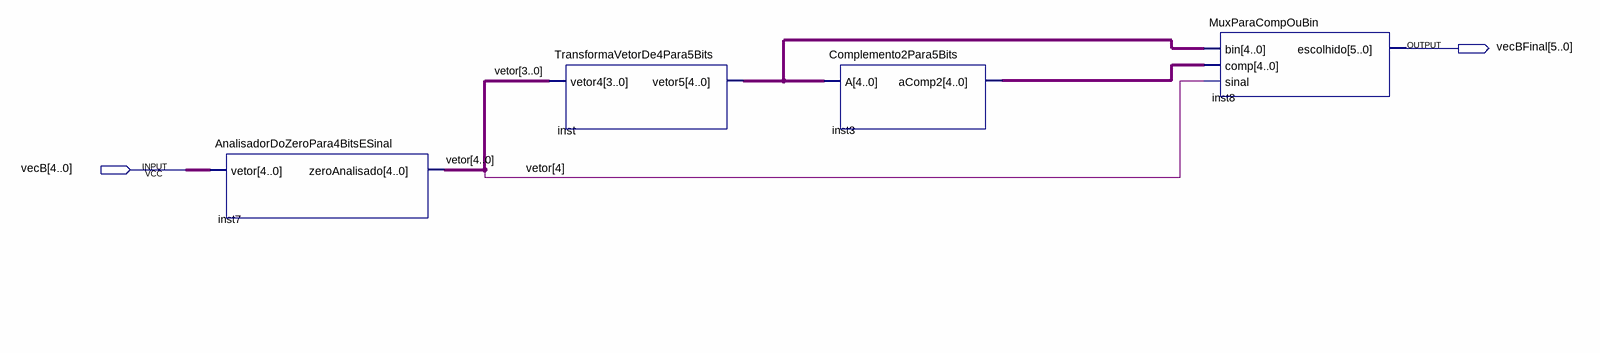
[diagram p0: schematic sheet]
// Quartus schematic Complemento2DeB.bdf as structural Verilog: 4 symbols, 2 pins
module Complemento2DeB (
  input  [4:0] vecB,
  output [5:0] vecBFinal
);

  wire [4:0] inst3_acomp2, inst_vetor5, vetor;

  AnalisadorDoZeroPara4BitsESinal inst7 (.vetor(vecB), .zeroAnalisado(vetor));
  TransformaVetorDe4Para5Bits inst (.vetor4(vetor[3:0]), .vetor5(inst_vetor5));
  Complemento2Para5Bits inst3 (.A(inst_vetor5), .aComp2(inst3_acomp2));
  MuxParaCompOuBin inst8 (.bin(inst_vetor5), .comp(inst3_acomp2), .sinal(vetor[4]), .escolhido(vecBFinal));
endmodule
